# Altium schematic sheet SD.SchDoc
size A4; SheetNumber: 7; SheetTotal: 8
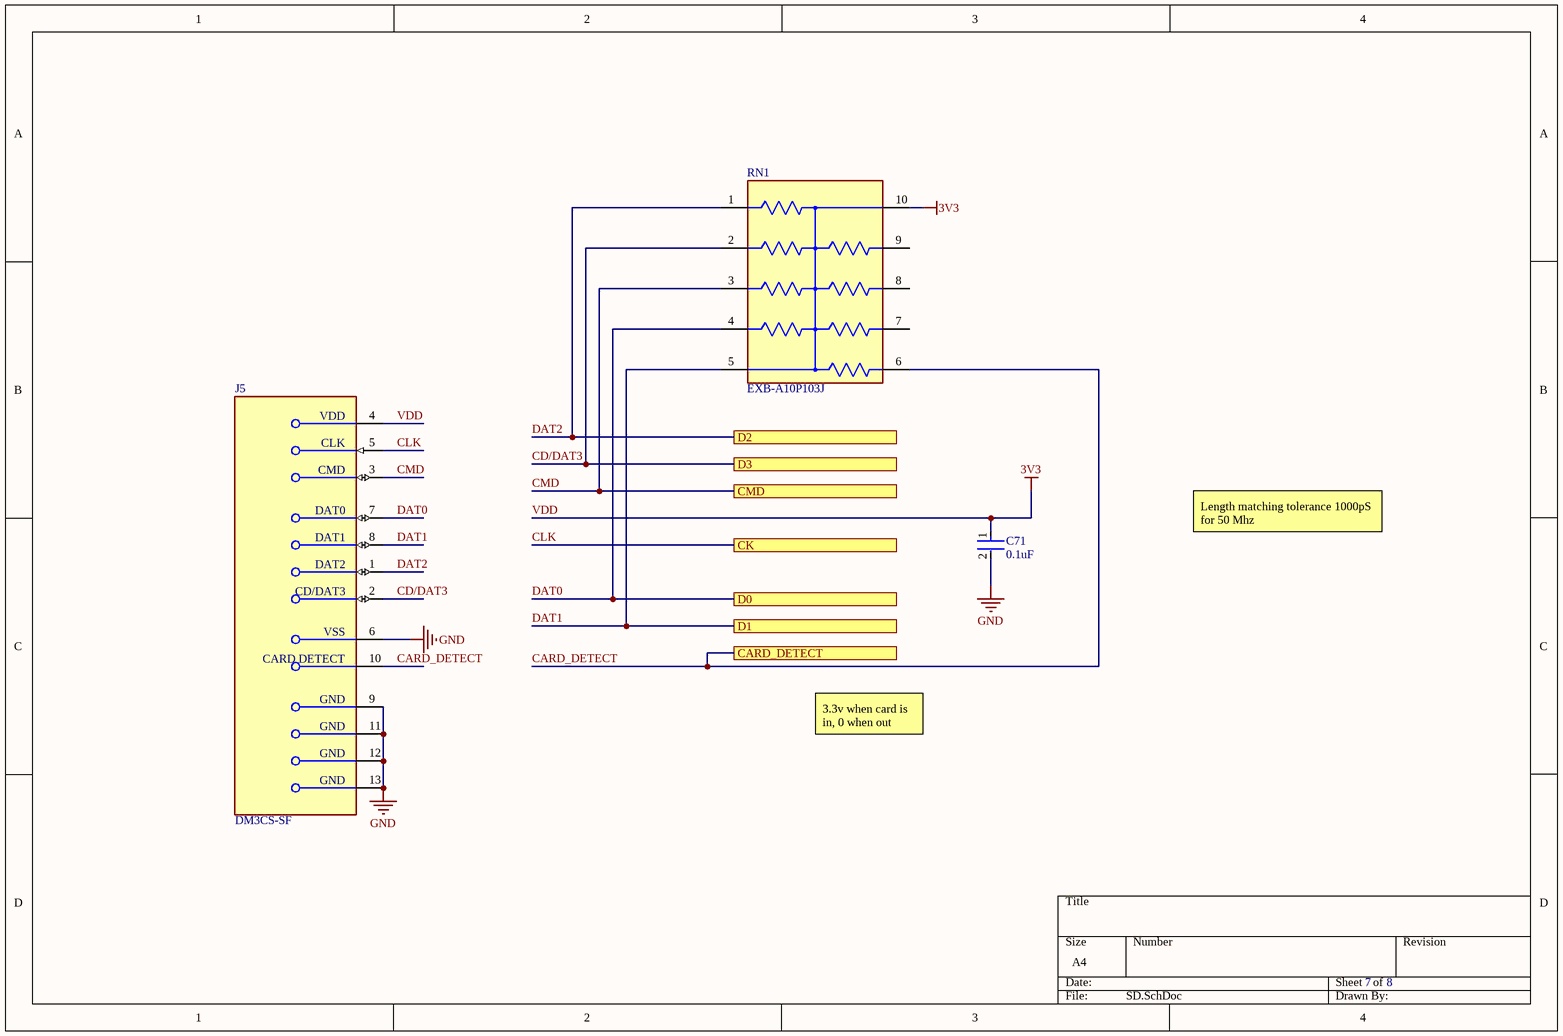
[diagram p0: SD.SchDoc]

## Parts
C71  0.1uF  [FP-CL10-IPC_C]
J5  DM3CS-SF  [FP-DM3CS-SF-MFG]
RN1  EXB-A10P103J  [FP-EXBA-MFG]

## Ports
CARD_DETECT, CK, CMD, D0, D1, D2, D3

## Nets
GND: C71.2 J5.6(VSS) J5.9(GND) J5.11(GND) J5.12(GND) J5.13(GND)
VDD: C71.1 J5.4(VDD) RN1.10  [also labelled 3V3]
CARD_DETECT: J5.10(CARD_DETECT) RN1.6 ; port CARD_DETECT
CD/DAT3: J5.2(CD/DAT3) RN1.2 ; port D3
CLK: J5.5(CLK) ; port CK
CMD: J5.3(CMD) RN1.3 ; port CMD
DAT0: J5.7(DAT0) RN1.4 ; port D0
DAT1: J5.8(DAT1) RN1.5 ; port D1
DAT2: J5.1(DAT2) RN1.1 ; port D2

Not connected (* = marked no-connect by the designer): RN1 7 8 9

## Notes on the sheet
- Length matching tolerance 1000pS for 50 Mhz
- 3.3v when card is in, 0 when out
- 7
- 8

## Library data of the parts
C71 = CMP-13271-002683-1: Cap Ceramic 100nF 16V X7R ±10% Pad SMD 0603 +125°C T/R / CL10B104KO8WPNC; Voltage Rating: 16V; Max Operating Temperature: 125°C; Capacitance: 100nF; Features: Soft Termination; Length: 0.063inch; Packaging: Tape and Reel; Min Operating Temperature: -55°C; Mount: Surface Mount; Case/Package: 0603; Case Code (Metric): 1608; Width: 0.031inch; Ratings: AEC-Q200; Thickness: 0.035inch; Case Code (Imperial): 0603; Tolerance: 10%
J5 = CMP-11597-000003-1: CONN MICRO SD CARD HINGED TYPE; Pitch: 1.1mm; Connector Type: Connector; Current Rating: 500mA; Voltage Rating (AC): 125V; Gender: Female; Insulation Resistance: 1GR; Number of Positions: 8; Contact Resistance: 100mR; Packaging: Tape and Reel; Flammability Rating: UL94 V-0; Lead Free: Lead Free; Min Operating Temperature: -25°C; Orientation: Right Angle; Width: 13.8mm; Number of Rows: 1; Housing Material: Polymer; Package Quantity: 1; Mount: Surface Mount; Max Current Rating: 500mA; Radiation Hardening: No; Max Operating Temperature: 85°C; Contact Plating: Gold; Depth: 1.83mm; Contact Material: Gold; Length: 14.1mm; Number of Contacts: 8; Termination: Solder
RN1 = CMP-00287-42270834-1: EXB-A10P103J Res Thick Film NET 10K Ohm 5% ±200ppm/℃ BUS Molded 10-Pin 2512 Concave SMD Embossed Carrier T/R; Resistance: 10kΩ; Number of Elements: 8; Power Dissipation: 63mW; Voltage Rating (DC): 100V; Voltage Rating: 50V; Circuit Type: Bussed; Power Per Element: 62.5mW; Number of Contacts: 10; Temperature Coefficient: 200ppm/°C; Length: 6.4mm; Number of Terminals: 10; Depth: 3.1mm; Radiation Hardening: No; Case Code (Imperial): 2512; Height: 660.4µm; Lifecycle Status: Production; Lead Free: Lead Free; Military Standard: Not; Case/Package: 2512; Min Operating Temperature: -55°C; Terminal Pitch: 1.27mm; Packaging: Cut Tape; Tolerance: 5%; Number of Pins: 10; Width: 3.1mm; NexarPartId: 42270834; Case Code (Metric): 6432; RoHS: Compliant; Max Operating Temperature: 125°C; Number of Resistors: 8; REACH SVHC: Unknown; Termination: Concave; Mount: Surface Mount